# EAGLE schematic yellowstone-walach-aerospace-cubesat-sch (EAGLE 9.7.0)
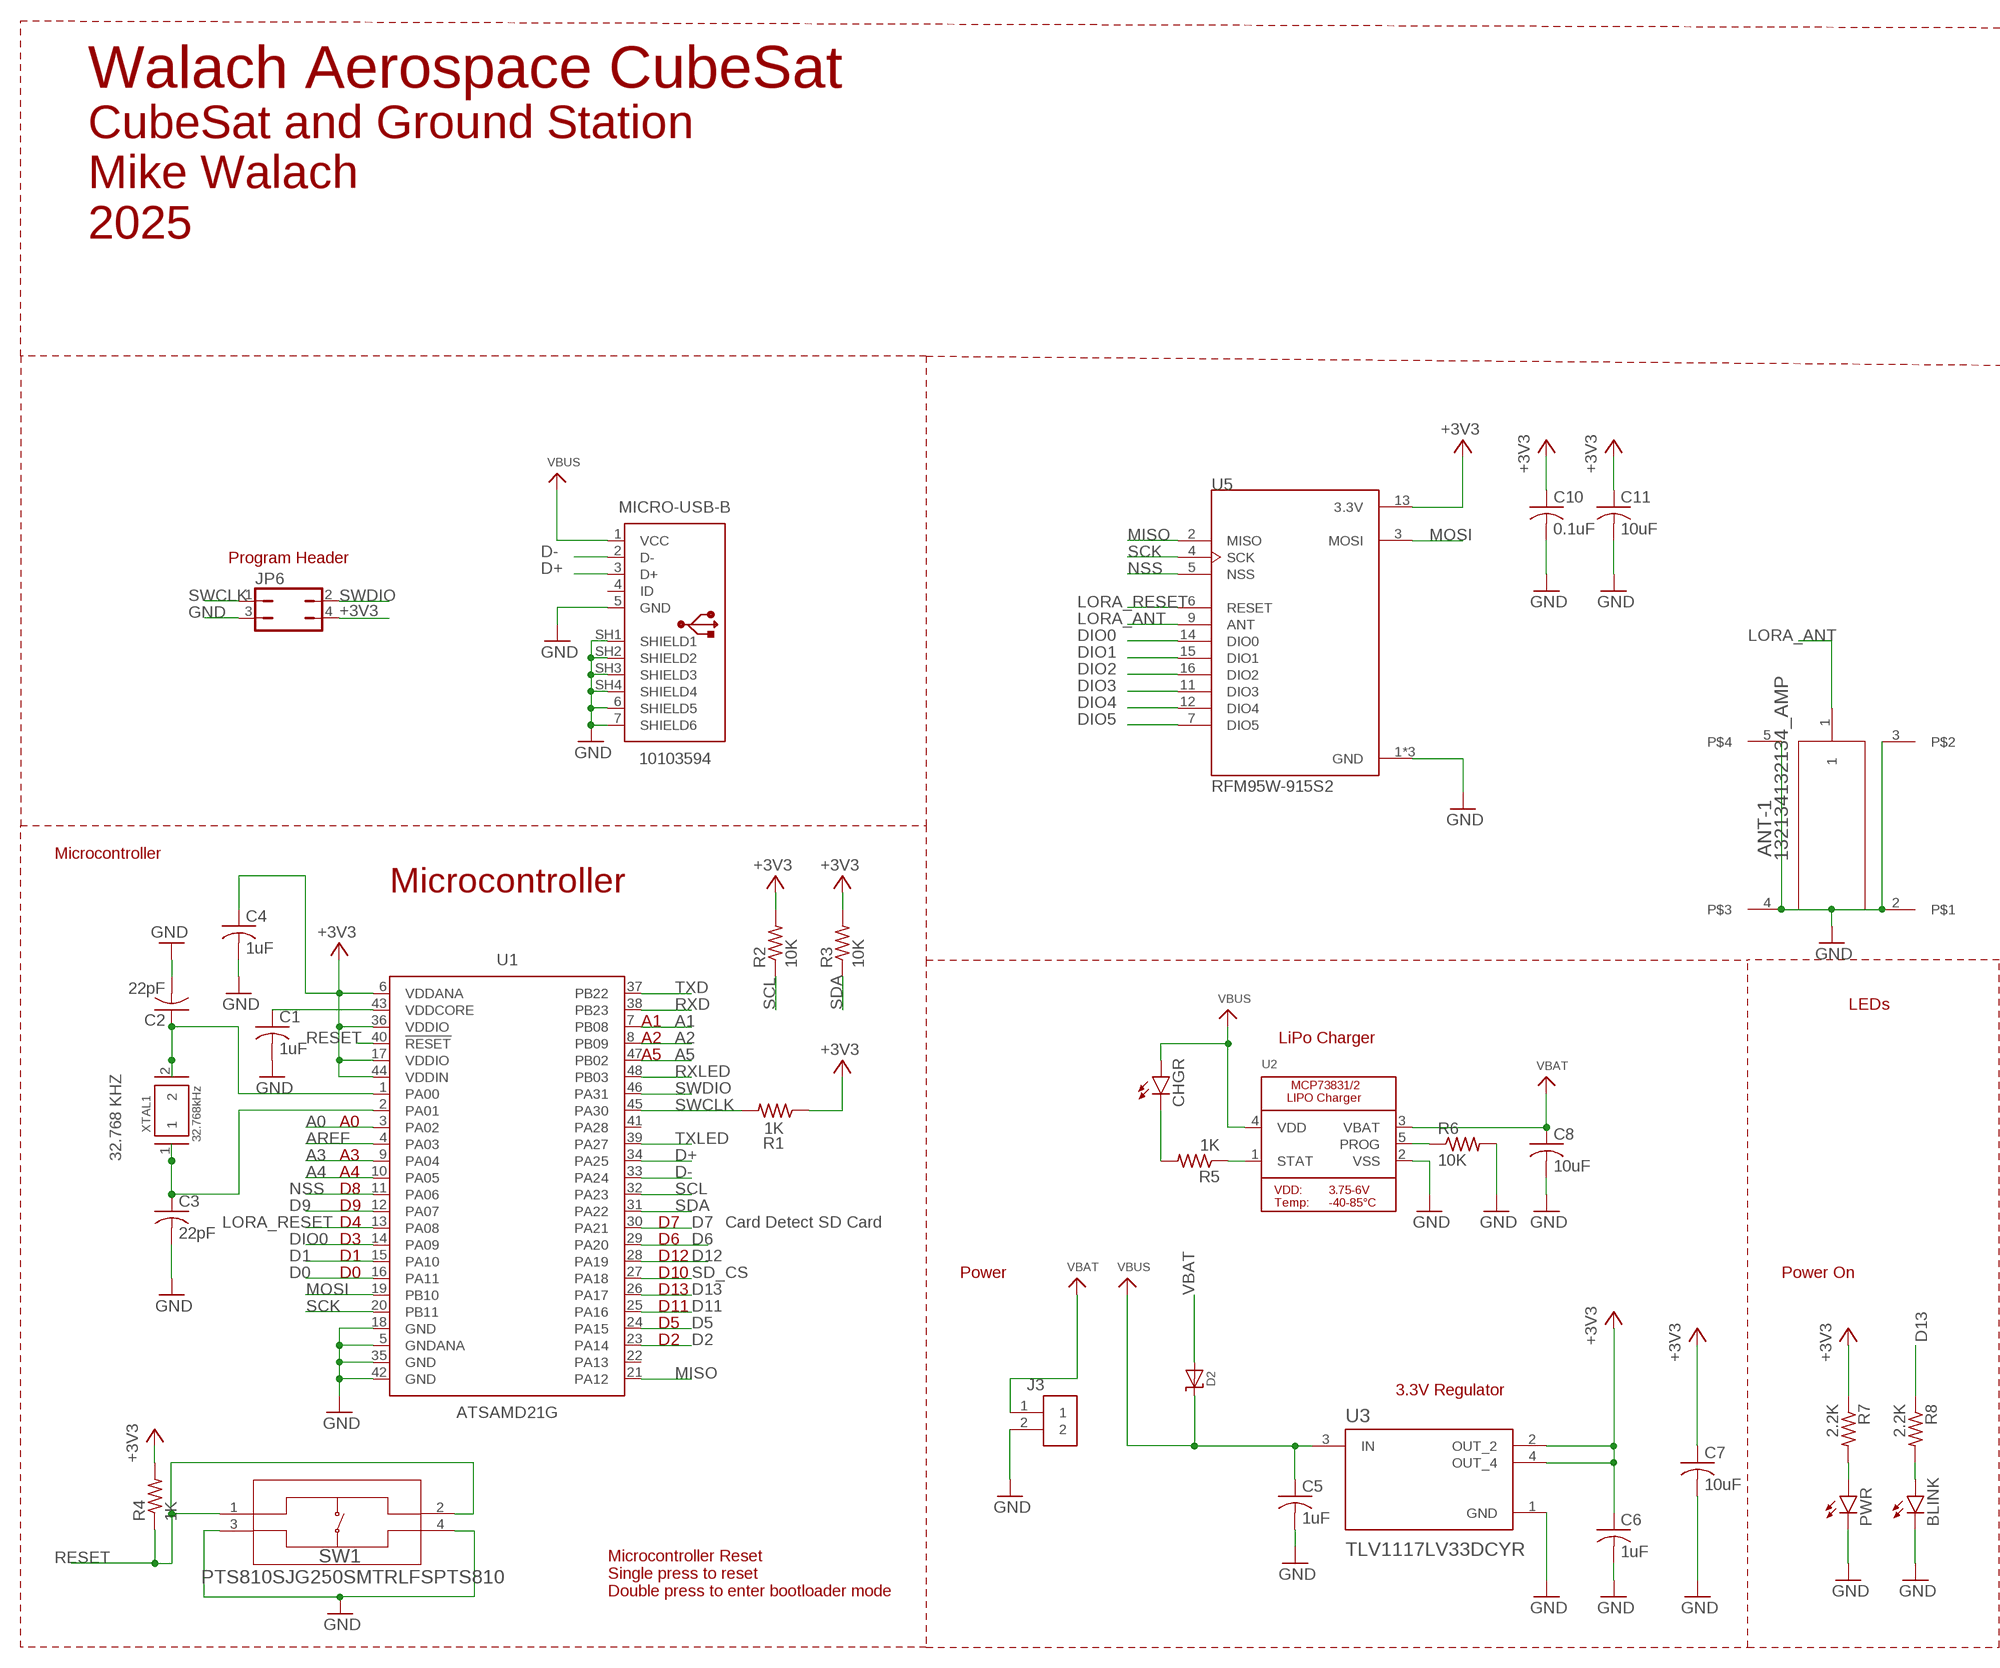
[diagram p0: schematic, sheet 1, part 1 of 2]
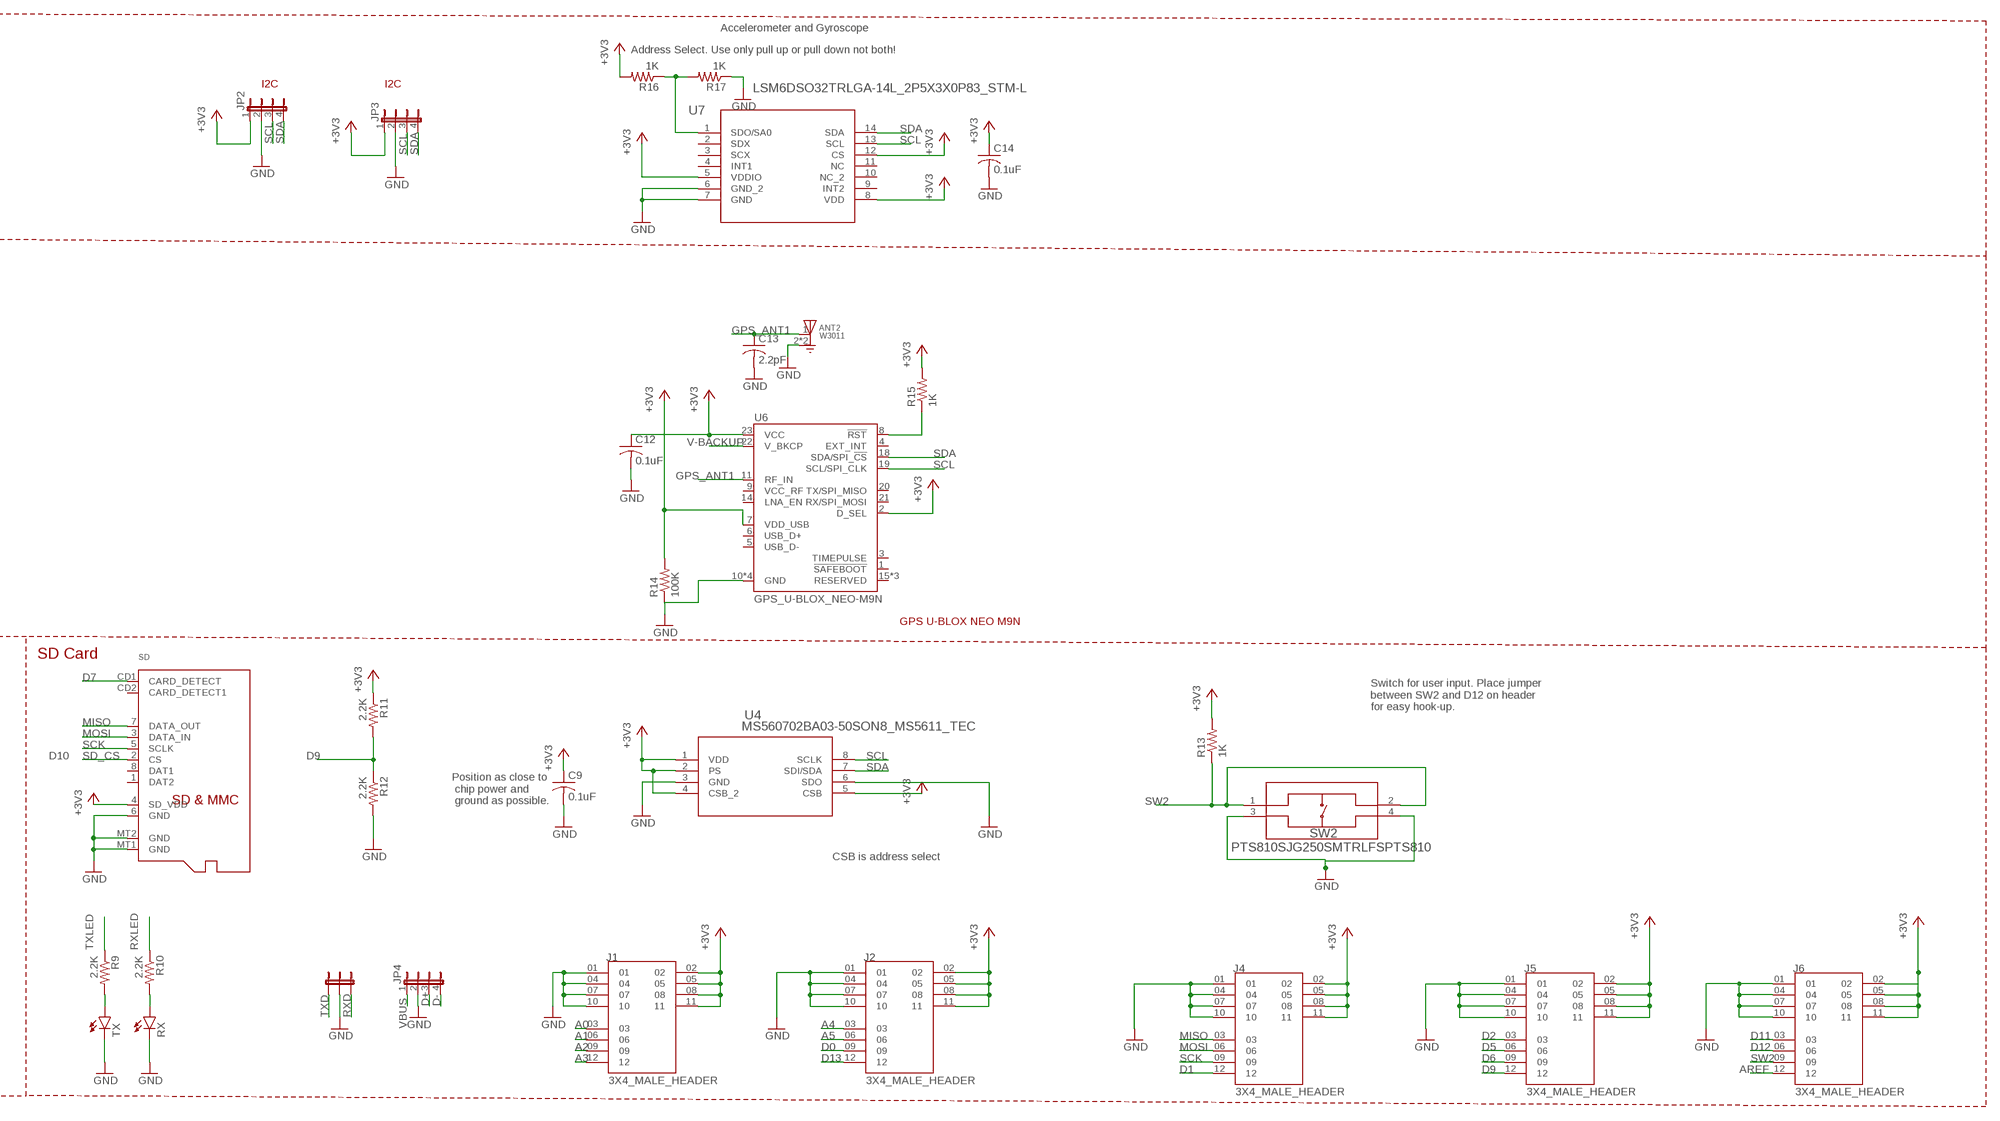
[diagram p1: schematic, sheet 1, part 2 of 2]

## Parts
ANT2  W3011  [XDCR_W3011]
ANT-1  132134132134_AMP  [132134_AMP]
BLINK  LEDSML0805  [SML0805]
C1  1uF  C-USC0805  [C0805]
C2  22pF  C-USC0805  [C0805]
C3  22pF  C-USC0805  [C0805]
C4  1uF  C-USC0805  [C0805]
C5  1uF  C-USC0805  [C0805]
C6  1uF  C-USC0805  [C0805]
C7  10uF  C-USC0805  [C0805]
C8  10uF  C-USC0805  [C0805]
C9  0.1uF  C-USC0805  [C0805]
C10  0.1uF  C-USC0805  [C0805]
C11  10uF  C-USC0805  [C0805]
C12  0.1uF  C-USC0805  [C0805]
C13  2.2pF  C-USC0805  [C0805]
C14  0.1uF  C-USC0805  [C0805]
CHGR  LEDSML0805  [SML0805]
D2  MICROBUILDER_DIODE-SCHOTTKYSOD-123  [MICROBUILDER_SOD-123]
J1  3X4_MALE_HEADER  [TSW-104-07-F-T_SAMTEC_TSW-104-07-F-T]
J2  3X4_MALE_HEADER  [TSW-104-07-F-T_SAMTEC_TSW-104-07-F-T]
J3  S2B-PH-K-S(LF)(SN)  [S2B-PH-K-S(LF)(SN)]
J4  3X4_MALE_HEADER  [TSW-104-07-F-T_SAMTEC_TSW-104-07-F-T]
J5  3X4_MALE_HEADER  [TSW-104-07-F-T_SAMTEC_TSW-104-07-F-T]
J6  3X4_MALE_HEADER  [TSW-104-07-F-T_SAMTEC_TSW-104-07-F-T]
JP2  JP4E  [JP4]
JP3  JP4E  [JP4]
JP4  JP4E  [JP4]
JP5  3-PIN-JUMPER  [3-PIN-JUMPER]
JP6  JP2Q  [JP2Q]
MICRO-USB-B  10103594  [10103594]
PWR  LEDSML0805  [SML0805]
R1  1K  R-US_R0805  [R0805]
R2  10K  R-US_R0805  [R0805]
R3  10K  R-US_R0805  [R0805]
R4  1K  R-US_R0805  [R0805]
R5  1K  R-US_R0805  [R0805]
R6  10K  R-US_R0805  [R0805]
R7  2.2K  R-US_R0805  [R0805]
R8  2.2K  R-US_R0805  [R0805]
R9  2.2K  R-US_R0805  [R0805]
R10  2.2K  R-US_R0805  [R0805]
R11  2.2K  R-US_R0805  [R0805]
R12  2.2K  R-US_R0805  [R0805]
R13  1K  R-US_R0805  [R0805]
R14  100K  R-US_R0805  [R0805]
R15  1K  R-US_R0805  [R0805]
R16  1K  R-US_R0805  [R0805]
R17  1K  R-US_R0805  [R0805]
RX  LEDSML0805  [SML0805]
SD  MICROBUILDER_MICROSD  [MICROBUILDER_MICROSD]
SW1  PTS810SJG250SMTRLFSPTS810  [PTS810]
SW2  PTS810SJG250SMTRLFSPTS810  [PTS810]
TX  LEDSML0805  [SML0805]
U1  ATSAMD21G  ATSAMD21G_TQFP  [QFP50P900X900X120-48]
U2  MICROBUILDER_MCP73831/2  [MICROBUILDER_SOT23-5]
U3  TLV1117LV33DCYR  [VREG_TLV1117LV33DCYR]
U4  MS560702BA03-50SON8_MS5611_TEC  [SON8_MS5611_TEC]
U5  RFM95W-915S2  [XCVR_RFM95W-915S2]
U6  GPS_U-BLOX_NEO-M9N  [GPS_NEO-M9N]
U7  LSM6DSO32TRLGA-14L_2P5X3X0P83_STM-L  [LGA-14L_2P5X3X0P83_STM-L]
XTAL1  32.768kHz  ABSO7  [XTAL_ABS07-32.768KHZ-T]

## Nets
+3V3: C4.1 C6.1 C7.1 C9.1 C10.1 C11.1 C12.1 C14.1 J1.02 J1.05 J1.08 J1.11 J2.02 J2.05 J2.08 J2.11 J4.02 J4.05 J4.08 J4.11 J5.02 J5.05 J5.08 J5.11 J6.02 J6.05 J6.08 J6.11 JP2.1 JP3.1 JP6.4 R1.1 R2.2 R3.2 R4.2 R7.1 R11.1 R13.2 R14.2 R15.2 R16.2 SD.4(SD_VDD) U1.6(VDDANA) U1.17(VDDIO) U1.36(VDDIO) U1.44(VDDIN) U3.2(OUT_2) U3.4(OUT_4) U4.1(VDD) U4.2(PS) U4.4(CSB_2) U4.5(CSB) U5.13(3.3V) U6.2(D_SEL) U6.7(VDD_USB) U6.23(VCC) U7.5(VDDIO) U7.8(VDD) U7.12(CS)
A0: J1.03 U1.3(PA02)
A1: J1.06 U1.7(PB08)
A2: J1.09 U1.8(PB09)
A3: J1.12 U1.9(PA04)
A4: J2.03 U1.10(PA05)
A5: J2.06 U1.47(PB02)
AREF: J6.12 U1.4(PA03)
D0: J2.09 U1.16(PA11)
D1: J4.12 U1.15(PA10)
D2: J5.03 U1.23(PA14)
D5: J5.06 U1.24(PA15)
D6: J5.09 U1.29(PA20)
D7: SD.CD1(CARD_DETECT) U1.30(PA21)
D9: J5.12 R11.2 R12.1 U1.12(PA07)
D11: J6.03 U1.25(PA16)
D12: J6.06 U1.28(PA19)
D13: J2.12 R8.1 U1.26(PA17)
D+: JP4.3 MICRO-USB-B.3(D+) U1.34(PA25)
D-: JP4.4 MICRO-USB-B.2(D-) U1.33(PA24)
DIO0: U1.14(PA09) U5.14(DIO0)
DIO1: U5.15(DIO1)
DIO2: U5.16(DIO2)
DIO3: U5.11(DIO3)
DIO4: U5.12(DIO4)
DIO5: U5.7(DIO5)
GND: ANT2.2(GND) ANT2.3(GND) ANT-1.2 ANT-1.3 ANT-1.4 ANT-1.5 BLINK.C C1.2 C2.2 C3.2 C4.2 C5.2 C6.2 C7.2 C8.2 C9.2 C10.2 C11.2 C12.2 C13.2 C14.2 J1.01 J1.04 J1.07 J1.10 J2.01 J2.04 J2.07 J2.10 J3.2 J4.01 J4.04 J4.07 J4.10 J5.01 J5.04 J5.07 J5.10 J6.01 J6.04 J6.07 J6.10 JP2.2 JP3.2 JP4.2 JP5.2 JP6.3 MICRO-USB-B.5(GND) MICRO-USB-B.6(SHIELD5) MICRO-USB-B.7(SHIELD6) MICRO-USB-B.SH1(SHIELD1) MICRO-USB-B.SH2(SHIELD2) MICRO-USB-B.SH3(SHIELD3) MICRO-USB-B.SH4(SHIELD4) PWR.C R6.2 R12.2 R14.1 R17.1 RX.C SD.6(GND) SD.MT1(GND) SD.MT2(GND) SW1.3 SW1.4 SW2.3 SW2.4 TX.C U1.5(GNDANA) U1.18(GND) U1.35(GND) U1.42(GND) U2.2(VSS) U3.1(GND) U4.3(GND) U4.6(SDO) U5.1(GND) U5.8(GND) U5.10(GND) U6.10(GND) U6.12(GND) U6.13(GND) U6.24(GND) U7.6(GND_2) U7.7(GND)
GPS_ANT1: ANT2.1(FEED) C13.1 U6.11(RF_IN)
LORA_ANT: ANT-1.1 U5.9(ANT)
LORA_RESET: U1.13(PA08) U5.6(RESET)
MISO: J4.03 SD.7(DATA_OUT) U1.21(PA12) U5.2(MISO)
MOSI: J4.06 SD.3(DATA_IN) U1.19(PB10) U5.3(MOSI)
N$2: C1.1 U1.43(VDDCORE)
N$4: R5.1 U2.1(STAT)
N$6: CHGR.C R5.2
N$7: R6.1 U2.5(PROG)
N$8: BLINK.A R8.2
N$9: R9.2 TX.A
N$10: R10.2 RX.A
N$11: R15.1 U6.8(!RST)
N$12: C3.1 U1.2(PA01) XTAL1.1
N$14: R16.1 R17.2 U7.1(SDO/SA0)
N$15: C2.1 U1.1(PA00) XTAL1.2
N$30: PWR.A R7.2
NSS: U1.11(PA06) U5.5(NSS)
RESET: R4.1 SW1.1 SW1.2 U1.40(!RESET)
RXD: JP5.3 U1.38(PB23)
RXLED: R10.1 U1.48(PB03)
SCK: J4.09 SD.5(SCLK) U1.20(PB11) U5.4(SCK)
SCL: JP2.3 JP3.3 R2.1 U1.32(PA23) U4.8(SCLK) U6.19(SCL/SPI_CLK) U7.13(SCL)
SD_CS: SD.2(CS) U1.27(PA18)
SDA: JP2.4 JP3.4 R3.1 U1.31(PA22) U4.7(SDI/SDA) U6.18(SDA/SPI_!CS!) U7.14(SDA)
SW2: J6.09 R13.1 SW2.1 SW2.2
SWCLK: JP6.1 R1.2 U1.45(PA30)
SWDIO: JP6.2 U1.46(PA31)
TXD: JP5.1 U1.37(PB22)
TXLED: R9.1 U1.39(PA27)
V-BACKUP: U6.22(V_BKCP)
VBAT: C8.1 D2.A J3.1 U2.3(VBAT)
VBUS: C5.1 CHGR.A D2.C JP4.1 MICRO-USB-B.1(VCC) U2.4(VDD) U3.3(IN)
Unconnected: MICRO-USB-B.4(ID) SD.1(DAT2) SD.8(DAT1) SD.CD2(CARD_DETECT1) U1.22(PA13) U1.41(PA28) U6.1(!SAFEBOOT!) U6.3(TIMEPULSE) U6.4(EXT_INT) U6.5(USB_D-) U6.6(USB_D+) U6.9(VCC_RF) U6.14(LNA_EN) U6.15(RESERVED) U6.16(RESERVED) U6.17(RESERVED) U6.20(TX/SPI_MISO) U6.21(RX/SPI_MOSI) U7.2(SDX) U7.3(SCX) U7.4(INT1) U7.9(INT2) U7.10(NC_2) U7.11(NC)

## Notes on the sheet
- Accelerometer and Gyroscope
- Walach Aerospace CubeSat
- Address Select. Use only pull up or pull down not both!
- I2C | I2C
- CubeSat and Ground Station
  Mike Walach
  2025
- Program Header
- Microcontroller
- Microcontroller
- GPS U-BLOX NEO M9N
- SD Card
- LEDs
- A1
- A2 | LiPo Charger
- A5
- Switch for user input. Place jumper 
  between SW2 and D12 on header 
  for easy hook-up.
- A0
- D10
- 32.768 KHZ | A3
- A4
- D8
- D9
- Position as close to
   chip power and
   ground as possible.
- D4 | D7 | Card Detect SD Card
- D3 | D6
- D1 | D12
- D0 | D10 | Power | Power On
- D13 | CSB is address select
- D11
- D5
- D2
- 3.3V Regulator
- Microcontroller Reset
  Single press to reset
  Double press to enter bootloader mode

## Library data of the parts
ANT2 = W3011:W3011: Antenna Ceramic 3.4dB Gain 1585.42MHz SMD; MANUFACTURER: PulseLarsen; MAXIMUM_PACKAGE_HEIGHT: 1.3 mm; PARTREV: N/A; STANDARD: Manufacturer recommendations
ANT-1 = 2025-03-19_02-22-58_Library:132134; COPYRIGHT: Copyright (C) 2025 Ultra Librarian. All rights reserved.; MANUFACTURER_PART_NUMBER: 132134; MFR_NAME: Amphenol ICC
BLINK CHGR PWR RX TX = led:LED: LED OSRAM: - CHIPLED LG R971, LG N971, LY N971, LG Q971, LY Q971, LO R971, LY R971 LH N974, LH R974 LS Q976, LO Q976, LY Q976 LO Q996 - Hyper CHIPLED LW Q18S LB Q993, LB Q99A, LB R99A - SideLED LS A670, LO A670, LY A670, LG A670, LP A670 LB A673, LV A673, LT A673, LW A673 LH A674 LY A675 LS A676, LA A676, LO A676, LY A676, LW A676 LS A679, LY A679, LG A679 - Hyper Micro SIDELED® LS Y876, LA Y876, LO Y876, LY Y876 LT Y87S - SmartLED LW L88C, LW L88S LB L89C, LB L89S, LG L890 LS L89K, LO L89K, LY L89K LS L896, LA L896, LO L896, LY L896 - TOPLED LS T670, LO T670, LY T670, LG T670, LP T670 LSG T670, LSP T670, LSY T670, LOP T670, LYG T670 LG T671, LOG T671, LSG T671 LB T673, LV T673, LT T673, LW T673 LH T674 LS T676, LA T676, LO T676, LY T676, LB T676, LH T676, LSB T676, LW T676 LB T67C, LV T67C, LT T67C, LS T67K, LO T67K, LY T67K, LW E67C LS E67B, LA E67B, LO E67B, LY E67B, LB E67C, LV E67C, LT E67C LW T67C LS T679, LY T679, LG T679 LS T770, LO T770, LY T770, LG T770, LP T770 LB T773, LV T773, LT T773, LW T773 LH T774 LS E675, LA E675, LY E675, LS T675 LS T776, LA T776, LO T776, LY T776, LB T776 LHGB T686 LT T68C, LB T68C - Hyper Mini TOPLED® LB M676 - Mini TOPLED Santana® LG M470 LS M47K, LO M47K, LY M47K Source: http://www.osram.convergy.de LUXEON: - LUMILED® LXK2-PW12-R00, LXK2-PW12-S00, LXK2-PW14-U00, LXK2-PW14-V00 LXK2-PM12-R00, LXK2-PM12-S00, LXK2-PM14-U00 LXK2-PE12-Q00, LXK2-PE12-R00, LXK2-PE12-S00, LXK2-PE14-T00, LXK2-PE14-U00 LXK2-PB12-K00, LXK2-PB12-L00, LXK2-PB12-M00, LXK2-PB14-N00, LXK2-PB14-P00, LXK2-PB14-Q00 LXK2-PR12-L00, LXK2-PR12-M00, LXK2-PR14-Q00, LXK2-PR14-R00 LXK2-PD12-Q00, LXK2-PD12-R00, LXK2-PD12-S00 LXK2-PH12-R00, LXK2-PH12-S00 LXK2-PL12-P00, LXK2-PL12-Q00, LXK2-PL12-R00 Source: www.luxeon.com KINGBRIGHT: KA-3528ASYC Source: www.kingbright.com
C1-C14 = rcl:C-US: CAPACITOR, American symbol; SPICEPREFIX: C
D2 = flightcomputer-2023:MICROBUILDER_DIODE-SCHOTTKY
J1 J2 J4-J6 = BOBCAT_Library:3X4_MALE_HEADER; MANUFACTURER: Samtec; PARTREV: R; STANDARD: Manufacturer Recommendations
J3 = Connectors:S2B-PH-K-S(LF)(SN): CONN HEADER R/A 2POS 2MM Manufacturer's datasheet <http://www.jst-mfg.com/product/pdf/eng/ePH.pdf>; CREATED_BY: PCBLayout.com; DIGI_KEY_PART_NUMBER: 455-1719-ND; MANUFACTURER: JST Sales America Inc.; MPN: S2B-PH-K-S(LF)(SN)
JP2-JP4 = jumper:JP4E: JUMPER
JP5 = walach:3-PIN-JUMPER
JP6 = jumper:JP2Q: JUMPER
MICRO-USB-B = Connector_USB:10103594: USB(2.0) Micro-B, RCPT, 5POS, SMD-THT-R/A Datasheet <https://cdn.amphenol-icc.com/media/wysiwyg/files/documentation/datasheet/inputoutput/io_usb_micro.pdf> Drawing <https://cdn.amphenol-icc.com/media/wysiwyg/files/drawing/10103594.pdf>; CATEGORY: Connectors; CONTACTS: 5; CURRENT-RATING: 1.8A; DESCRIPTION: CONN RCPT USB2.0 MICRO B SMD R/A; GENDER: Receptacle; MANUFACTURER: Amphenol ICC (FCI); MOUNT_TYPE: R/A; MPN: 10103594-0001LF; OPERATING_TEMPERATURE: -30°C ~ 80°C; PART_STATUS: ACTIVE; ROHS_COMPLIANT: COMPLIANT; SUB_CATEGORY: USB; TYPE: USB-micro B; VOLTAGE-RATING: 100VAC
R1-R17 = rcl:R-US_: RESISTOR, American symbol; SPICEPREFIX: R
SD = flightcomputer-2023:MICROBUILDER_MICROSD: MicroSD/Transflash Card Holder with SPI pinout 3M: 2908-05WB-MG 4UConnector: 19656 Footprint courtesy: Adafruit Industries
SW1 SW2 = 2024-06-17_17-27-14_Library:PTS810SJG250SMTRLFS; COPYRIGHT: Copyright (C) 2024 Ultra Librarian. All rights reserved.; MANUFACTURER_PART_NUMBER: PTS810SJG250SMTRLFS; MFR_NAME: C&K Components
U1 = IC_Embedded:ATSAMD21G*: 32-bit ARM-Based Microcontrollers Datasheet <http://ww1.microchip.com/downloads/en/devicedoc/40001884a.pdf> Note:For this part User needs to add thermal via in thermal pad in QFN package while designing a board.; CATEGORY: IC_Embedded; CORE: ARM Cortex M0+; DESCRIPTION: Low-power, high-performance Microchip's ARM® Cortex®-M0+ based flash microcontroller; MANUFACTURER: Microchip Technology; MPN: ATSAMD21G; OPERATING_TEMP: variable; PACKAGE: TQFP-48; PART_STATUS: Active; ROHS_COMPLIANT: COMPLIANT; SERIES: SAM D21G; SUB-CATEGORY: Microcontroller; TYPE: 32 bit Microcontroller
U2 = flightcomputer-2023:MICROBUILDER_MCP73831/2: MCP73831/2 LIPO Charger VDD: 3.75 - 6V Temp -40 - 85°C Programmable Charge Rate: 15-500mA NOTE: STAT is a tri-state logic output on the MCP73831 and an open-drain output on the MCP73832. SOT23-5 with 4.2V output and tri-state logic on STAT = MCP73831T-2ACI/OT
U3 = TLV1117LV33DCYR:TLV1117LV33DCYR; MANUFACTURER: Texas Instruments; MAXIMUM_PACKAGE_HEIGHT: 1.80 mm; PARTREV: B; STANDARD: IPC-7351B
U4 = 2025-03-19_19-02-07_Library:MS560702BA03-50; COPYRIGHT: Copyright (C) 2025 Ultra Librarian. All rights reserved.; MANUFACTURER_PART_NUMBER: MS560702BA03-50; MFR_NAME: TE Connectivity
U5 = RFM95W-915S2:RFM95W-915S2: Check availability <https://pricing.snapeda.com/parts/RFM95W-915S2/RF%20Solutions/view-part?ref=eda>; AVAILABILITY: In Stock; CHECK_PRICES: https://www.snapeda.com/parts/RFM95W-915S2/RF/view-part/?ref=eda; DESCRIPTION: 802.15.4 LoRa™ Transceiver Module 915MHz Antenna Not Included Surface Mount; MF: RF Solutions; MP: RFM95W-915S2; PACKAGE: Non Standard RF Solutions; PRICE: None; PURCHASE-URL: https://www.snapeda.com/api/url_track_click_mouser/?unipart_id=585488&manufacturer=RF Solutions&part_name=RFM95W-915S2&search_term=None; SNAPEDA_LINK: https://www.snapeda.com/parts/RFM95W-915S2/RF/view-part/?ref=snap
U6 = SparkFun GPS NEO_M9N_ANT:GPS_U-BLOX_NEO-M9N: u-blox NEO-M9N GPS Module The NEO-M9N module is built on the robust u-blox M9 GNSS chip, which provides exceptional sensitivity and acquisition times for all L1 GNSS systems. The u-blox M9 standard precision GNSS platform, which delivers meter-level accuracy, succeeds the well-known u-blox M8 product range. The receiver also provides higher navigation rate and improved security features compared to previous u-blox GNSS generations. The NEO-M9N module is available in the NEO form factor LLC package; PROD_ID: IC-14651
U7 = 2023-12-05_15-44-33_Library:LSM6DSO32TR; COPYRIGHT: Copyright (C) 2023 Ultra Librarian. All rights reserved.; MANUFACTURER_PART_NUMBER: LSM6DSO32TR; MFR_NAME: STMicroelectronics
XTAL1 = Crystal-WA:ABSO7: CRYSTAL 32.7680KHZ 12.5PF SMD Datasheet <https://abracon.com/Resonators/ABS07.pdf>; CATEGORY: Crystal; MANUFACTURER: Abracon LLC; MPN: ABS07-32.768KHZ-T; OPERATING_TEMPERATURE: -40°C ~ 85°C; PART_STATUS: ACTIVE; ROHS_COMPLIANT: COMPLIANT; SERIES: ABS07; SUB_CATEGORY: Crystal Surface Mount; TYPE: Crystal